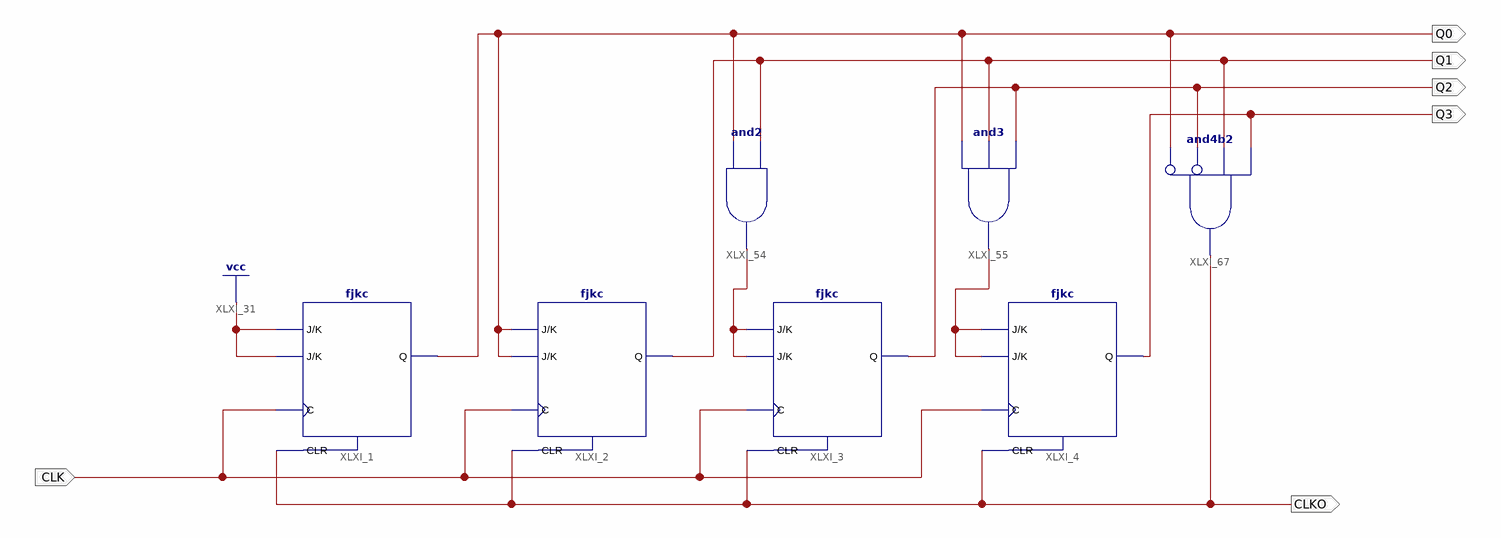
[diagram p0: schematic sheet 1]
// Xilinx ISE schematic counterbcd.sch (spartan6) as structural Verilog: 7 symbols, 6 ports
module counterbcd (
  input  CLK,
  output Q0,
  output Q3,
  output CLKO,
  output Q1,
  output Q2
);

  wire XLXN_77, XLXN_78;

  fjkc XLXI_1 (.C(CLK), .CLR(CLKO), .J(1'b1), .K(1'b1), .Q(Q0));
  fjkc XLXI_2 (.C(CLK), .CLR(CLKO), .J(Q0), .K(Q0), .Q(Q1));
  fjkc XLXI_4 (.C(CLK), .CLR(CLKO), .J(XLXN_78), .K(XLXN_78), .Q(Q3));
  fjkc XLXI_3 (.C(CLK), .CLR(CLKO), .J(XLXN_77), .K(XLXN_77), .Q(Q2));
  and XLXI_54 (XLXN_77, Q0, Q1);
  and XLXI_55 (XLXN_78, Q0, Q1, Q2);
  and XLXI_67 (CLKO, ~Q0, ~Q2, Q1, Q3);  // and4b2
endmodule
